# Altium schematic sheet CH32V407RET-R0.SchDoc
size A3; SheetNumber: 1; SheetTotal: 6
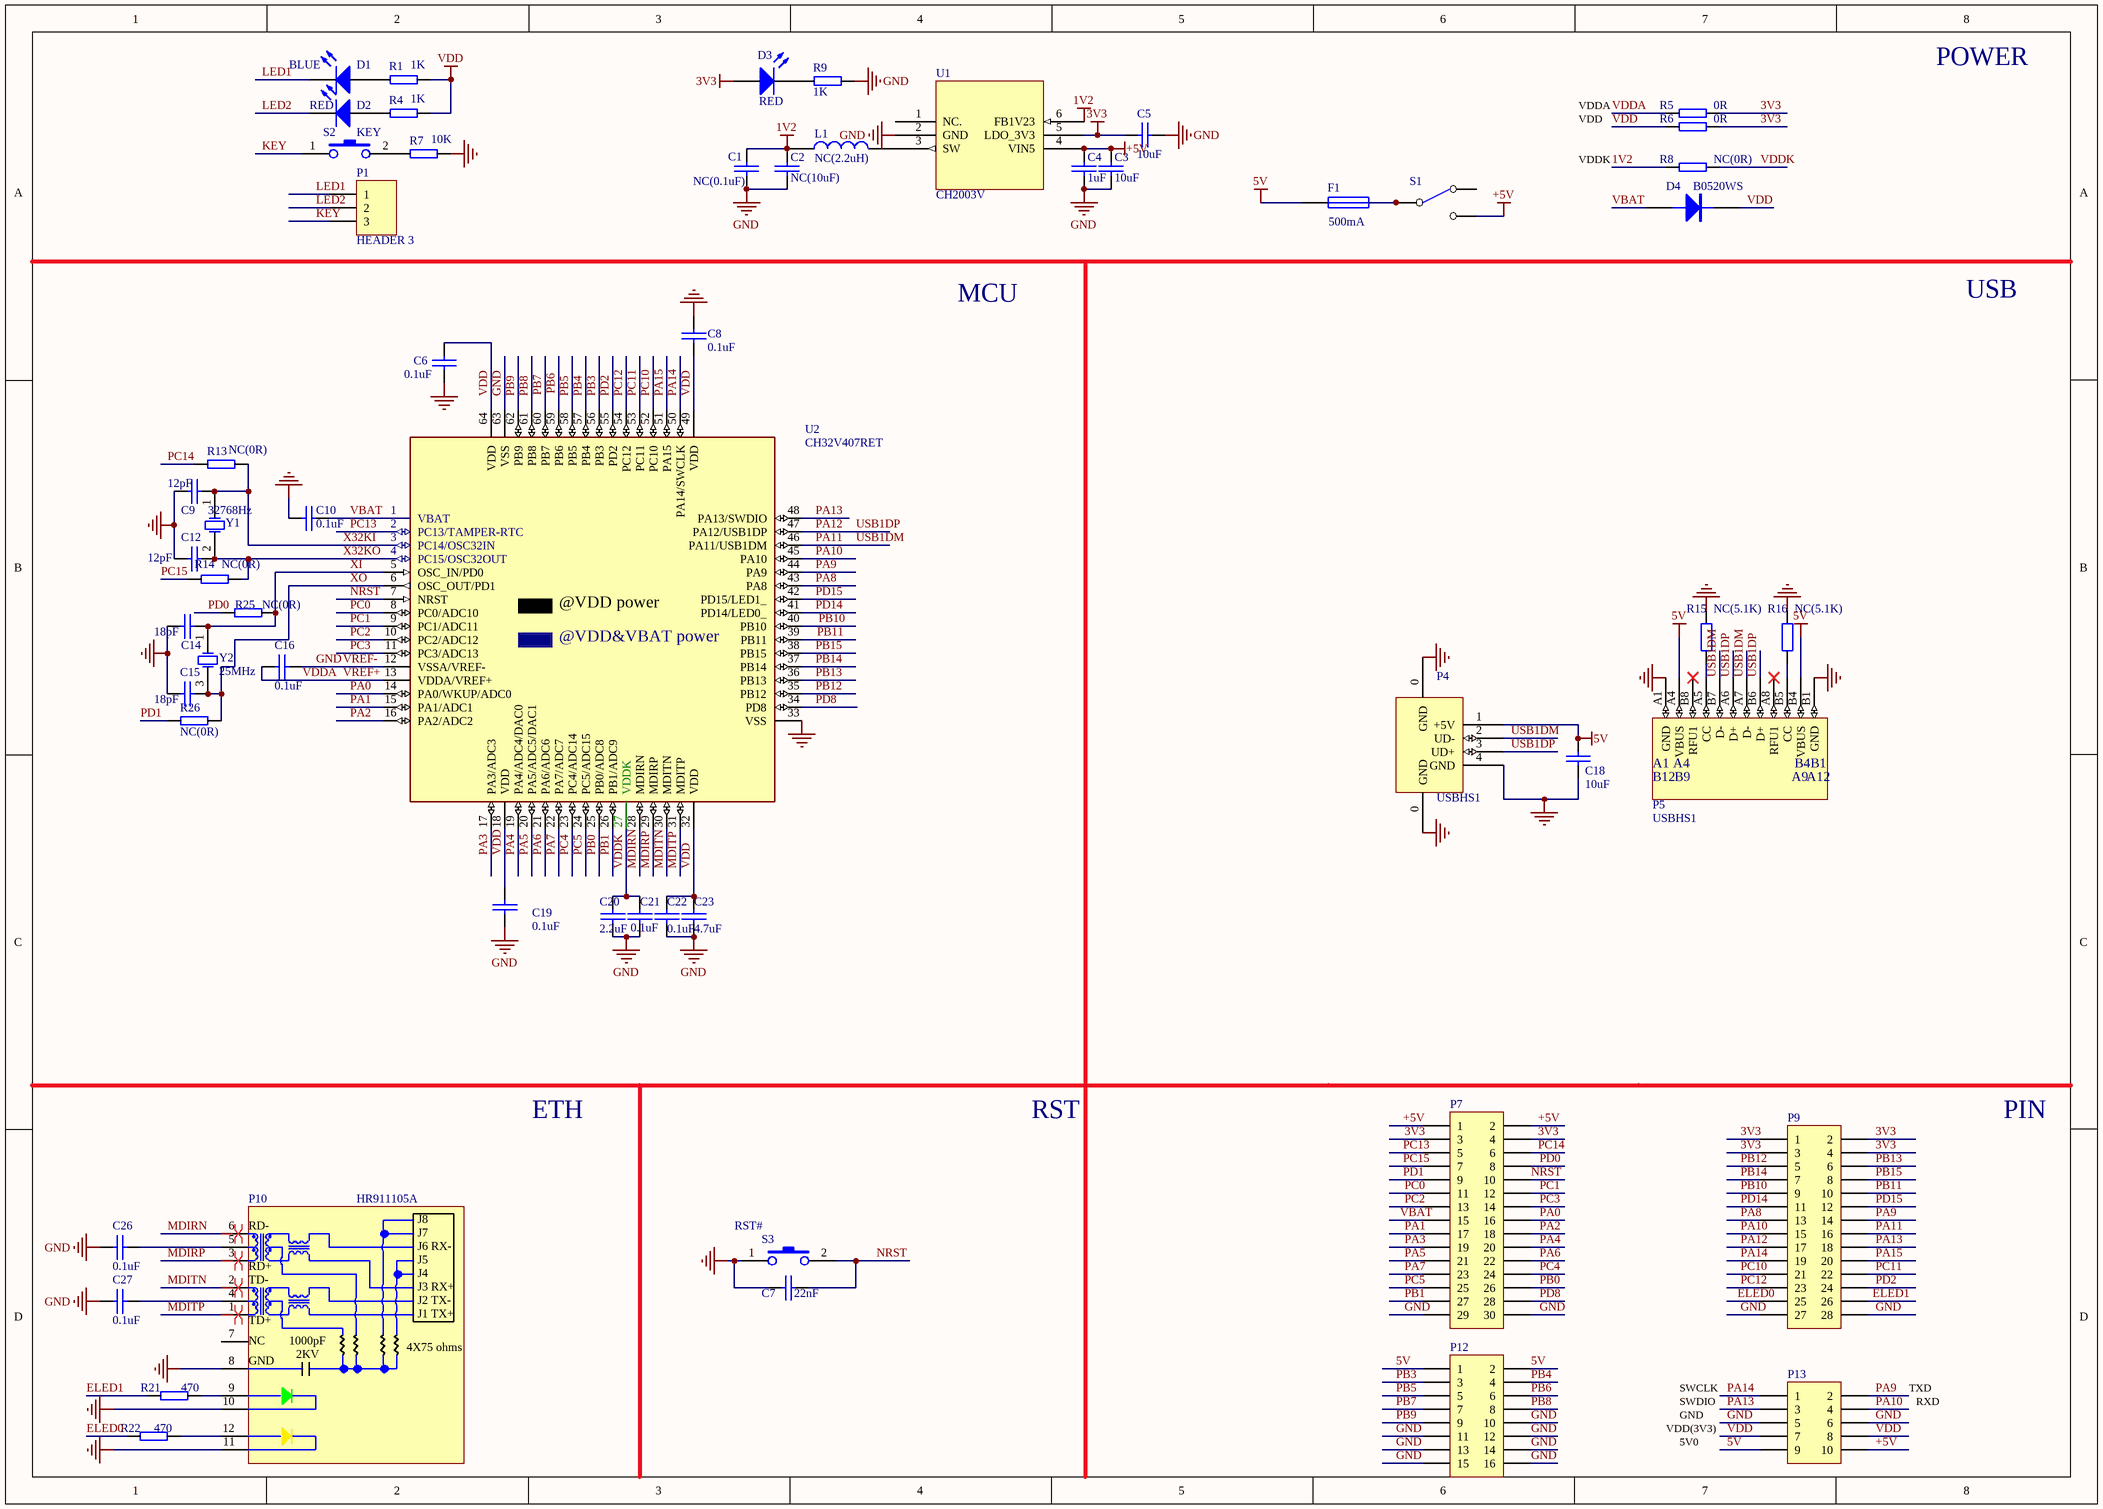
[diagram p0: CH32V407RET-R0.SchDoc]

## Parts
C1  NC(0.1uF)  [0402_C]
C2  NC(10uF)  [0603_C]
C3  10uF  [0603_C]
C4  1uF  [0402_C]
C5  10uF  [0603_C]
C6  0.1uF  [0402_C]
C7  22nF  [0402_C]
C8  0.1uF  [0402_C]
C9  12pF  [0402_C]
C10  0.1uF  [0402_C]
C12  12pF  [0402_C]
C14  18pF  [0402_C]
C15  18pF  [0402_C]
C16  0.1uF  [0402_C]
C18  10uF  [0603_C]
C19  0.1uF  [0402_C]
C20  2.2uF  [0402_C]
C21  0.1uF  [0402_C]
C22  0.1uF  [0402_C]
C23  4.7uF  [0402_C]
C26  0.1uF  [0402_C]
C27  0.1uF  [0402_C]
D1  BLUE  [0603+]
D2  RED  [0603+]
D3  RED  [0603+]
D4  B0520WS  [SOD-323]
F1  500mA  [0603]
L1  NC(2.2uH)  [CD32]
P1  HEADER 3  [SIP3-2.54MM]
P4  USBHS1  [USBAF]
P5  USBHS1  [TYPE-C-Receptacle-2.0]
P7  HEADER 15x2  [IDC30-2.54MM]  (value not drawn)
P9  HEADER 14x2  [IDC28-2.54MM]  (value not drawn)
P10  HR911105A  [HR911105A]
P12  Ppin  [IDC16-2.54mm]  (value not drawn)
P13  LINK  [IDC10-2.54mm]  (value not drawn)
R1  1K  [0402]
R4  1K  [0402]
R5  0R  [0402]
R6  0R  [0402]
R7  10K  [0402]
R8  NC(0R)  [0402]
R9  1K  [0402]
R13  NC(0R)  [0402]
R14  NC(0R)  [0402]
R15  NC(5.1K)  [0402]
R16  NC(5.1K)  [0402]
R21  470  [0402]
R22  470  [0402]
R25  NC(0R)  [0402]
R26  NC(0R)  [0402]
S1  SW SPDT  [SW1]  (value not drawn)
S2  KEY  [SMD_6.1x3.65x2.5mm-KEY]
S3  RST#  [SMD_6.1x3.65x2.5mm-KEY]
U1  CH2003V  [SOT-23-6]
U2  CH32V407RET  [LQFP64_7X7]
Y1  32768Hz  [FC-135]
Y2  25MHz  [XT3225]

## Nets
1V2: C1.2 C2.2 L1.2 R8.2 U1.6(FB1V23)
3V3: C5.2 D3.1(A) P7.3 P7.4 P9.1 P9.2 P9.3 P9.4 R5.1 R6.1 U1.5(LDO_3V3)
5V: C18.1 F1.1 P4.1(+5V) P5.A4(VBUS) P5.B4(VBUS) P12.1 P12.2 P13.9
+5V: C3.2 C4.2 P7.1 P7.2 P13.10 S1.2(NC) U1.4(VIN5)
GND: C1.1 C2.1 C3.1 C4.1 C5.1 C6.1 C7.1 C8.2 C9.1 C10.1 C12.1 C14.1 C15.1 C16.2 C18.2 C19.1 C20.1 C21.1 C22.1 C23.1 C26.1 C27.1 P4.0(GND) P4.4(GND) P5.A1(GND) P5.B1(GND) P7.29 P7.30 P9.27 P9.28 P10.8 P10.10 P10.11 P12.10 P12.11 P12.12 P12.13 P12.14 P12.15 P12.16 P13.5 P13.6 R7.1 R9.2 R15.2 R16.2 S3.1 U1.2(GND) U2.12(VSSA/VREF-) U2.33(VSS) U2.63(VSS)  [also labelled VREF-]
VDD: C6.2 C8.1 C19.2 C22.2 C23.2 D4.2(K) P13.7 P13.8 R1.1 R4.1 R6.2 U2.18(VDD) U2.32(VDD) U2.49(VDD) U2.64(VDD)
ELED0: P9.25 R22.1
ELED1: P9.26 R21.1
KEY: P1.3 S2.1
LED1: D1.2(K) P1.1
LED2: D2.2(K) P1.2
MDIRN: P10.6 U2.28(MDIRN)
MDIRP: P10.3 U2.29(MDIRP)
MDITN: P10.2 U2.30(MDITN)
MDITP: P10.1 U2.31(MDITP)
NRST: C7.2 P7.10 S3.2 U2.7(NRST)
PA0: P7.16 U2.14(PA0/WKUP/ADC0)
PA1: P7.17 U2.15(PA1/ADC1)
PA2: P7.18 U2.16(PA2/ADC2)
PA3: P7.19 U2.17(PA3/ADC3)
PA4: P7.20 U2.19(PA4/ADC4/DAC0)
PA5: P7.21 U2.20(PA5/ADC5/DAC1)
PA6: P7.22 U2.21(PA6/ADC6)
PA7: P7.23 U2.22(PA7/ADC7)
PA8: P9.13 U2.43(PA8)
PA9: P9.14 P13.2 U2.44(PA9)
PA10: P9.15 P13.4 U2.45(PA10)
PA11: P4.2(UD-) P5.A7(D-) P5.B7(D-) P9.16 U2.46(PA11/USB1DM)  [also labelled USB1DM]
PA12: P4.3(UD+) P5.A6(D+) P5.B6(D+) P9.17 U2.47(PA12/USB1DP)  [also labelled USB1DP]
PA13: P9.18 P13.3 U2.48(PA13/SWDIO)
PA14: P9.19 P13.1 U2.50(PA14/SWCLK)
PA15: P9.20 U2.51(PA15)
PB0: P7.26 U2.25(PB0/ADC8)
PB1: P7.27 U2.26(PB1/ADC9)
PB3: P12.3 U2.56(PB3)
PB4: P12.4 U2.57(PB4)
PB5: P12.5 U2.58(PB5)
PB6: P12.6 U2.59(PB6)
PB7: P12.7 U2.60(PB7)
PB8: P12.8 U2.61(PB8)
PB9: P12.9 U2.62(PB9)
PB10: P9.9 U2.40(PB10)
PB11: P9.10 U2.39(PB11)
PB12: P9.5 U2.35(PB12)
PB13: P9.6 U2.36(PB13)
PB14: P9.7 U2.37(PB14)
PB15: P9.8 U2.38(PB15)
PC0: P7.11 U2.8(PC0/ADC10)
PC1: P7.12 U2.9(PC1/ADC11)
PC2: P7.13 U2.10(PC2/ADC12)
PC3: P7.14 U2.11(PC3/ADC13)
PC4: P7.24 U2.23(PC4/ADC14)
PC5: P7.25 U2.24(PC5/ADC15)
PC10: P9.21 U2.52(PC10)
PC11: P9.22 U2.53(PC11)
PC12: P9.23 U2.54(PC12)
PC13: P7.5 U2.2(PC13/TAMPER-RTC)
PC14: P7.6 R13.1
PC15: P7.7 R14.1
PD0: P7.8 R25.1
PD1: P7.9 R26.2
PD2: P9.24 U2.55(PD2)
PD8: P7.28 U2.34(PD8)
PD14: P9.11 U2.41(PD14/LED0_)
PD15: P9.12 U2.42(PD15/LED1_)
VBAT: C10.2 D4.1(A) P7.15 U2.1(VBAT)
VDDA: C16.1 R5.2 U2.13(VDDA/VREF+)  [also labelled VREF+]
VDDK: C20.2 C21.2 R8.1 U2.27(VDDK)
X32KI: C9.2 R13.2 U2.3(PC14/OSC32IN) Y1.1(OSC1)
X32KO: C12.2 R14.2 U2.4(PC15/OSC32OUT) Y1.2(OSC2)
XI: C14.2 R25.2 U2.5(OSC_IN/PD0) Y2.1(OSC1)
XO: C15.2 R26.1 U2.6(OSC_OUT/PD1) Y2.3(OSC2)
NetC26_2: C26.2 P10.5
NetC27_2: C27.2 P10.4
NetD1_1: D1.1(A) R1.2
NetD2_1: D2.1(A) R4.2
NetD3_2: D3.2(K) R9.1
NetF1_2: F1.2 S1.1(COMMON)
NetL1_1: L1.1 U1.3(SW)
NetP5_A5: P5.A5(CC) R15.1
NetP5_B5: P5.B5(CC) R16.1
NetP10_9: P10.9 R21.2
NetP10_12: P10.12 R22.2
NetR7_2: R7.2 S2.2

Not connected (* = marked no-connect by the designer): P5 A8(RFU1)* B8(RFU1)*; P10 7; S1 3(NO); U1 1(NC.)

## Layout directives
differential pair: MDIRN, MDIRP, MDITN, MDITP

## Notes on the sheet
- VDDA
- POWER
- VDDK
- VDD
- MCU
- USB
- ETH
- RST
- PIN
- SWCLK
- TXD
- VDD(3V3)
- SWDIO
- 5V0
- GND
- RXD
- (in symbol CH32V407RET) @VDD power; @VDD&VBAT power
- (in symbol HR911105A) J8; RD-; J7; J6; RX-; J5; RD+; J4; TD-; J3; RX+; J2; TX-; J1; TX+; TD+; NC; 1000pF; 4X75 ohms; 2KV; GND
- (in symbol TYPE-C1) B12; B9; A9; A12

## Library data of the parts
C1-C10 C12 C14-C16 C18-C23 C26 C27 = CAP: Capacitor
D1-D3 = LED0: Typical INFRARED GaAs LED; Published: 8-Jun-2000; LatestRevisionDate: 08-Jul-2005; LatestRevisionNote: Mech Layer 1 removed.; PackageReference: LED-0; Publisher: Altium Limited; PackageDescription: LED; 2 Leads
D4 = DIODE
F1 = FUSE1: Fuse
L1 = INDUCTOR
P1 = HEADER 3: Header, 3-Pin
P4 = USB: USB Port
P5 = TYPE-C1
P7 = HEADER 15x2: Header, 15-Pin, Dual row
P9 = HEADER 14x2: Header, 14-Pin, Dual row
P12 = Header 8X2H: Header, 8-Pin, Dual row, Right Angle; LatestRevisionDate: 17-Jul-2002; LatestRevisionNote: Re-released for DXP Platform.; Publisher: Altium Limited
P13 = Header 5X2H: Header, 5-Pin, Dual row, Right Angle; LatestRevisionDate: 17-Jul-2002; LatestRevisionNote: Re-released for DXP Platform.; Publisher: Altium Limited
R1 R4 R7 R9 R13 R14 R21 R22 R25 R26 = RES
R5 R6 R8 = R
R15 R16 = Res2: Resistor
S2 S3 = KEY1
U1 = CH2003V: Step-Down DC-DC Converter, 5V input, 1.23V * 800mA output, with LDO 3.3V * 200mA
U2 = CH32V407RET: RISC-V FPU HD-MCU, 175MHz, USB_480M, 100M Ethernet & Phy, CAN, ADC, DAC
Y1 Y2 = XTAL: Crystal Oscillator; Published: 8-Jun-2000; LatestRevisionDate: 17-Jul-2002; LatestRevisionNote: Re-released for DXP Platform.; PackageReference: R38; Publisher: Altium Limited; PackageDescription: Crystal, Thru-Hole; 2 Leads; Body 3.1 x 8.2 mm (Dia.xH)